# EAGLE schematic MotorDriver (EAGLE 9.6.2)

## Sheet 1 of 5
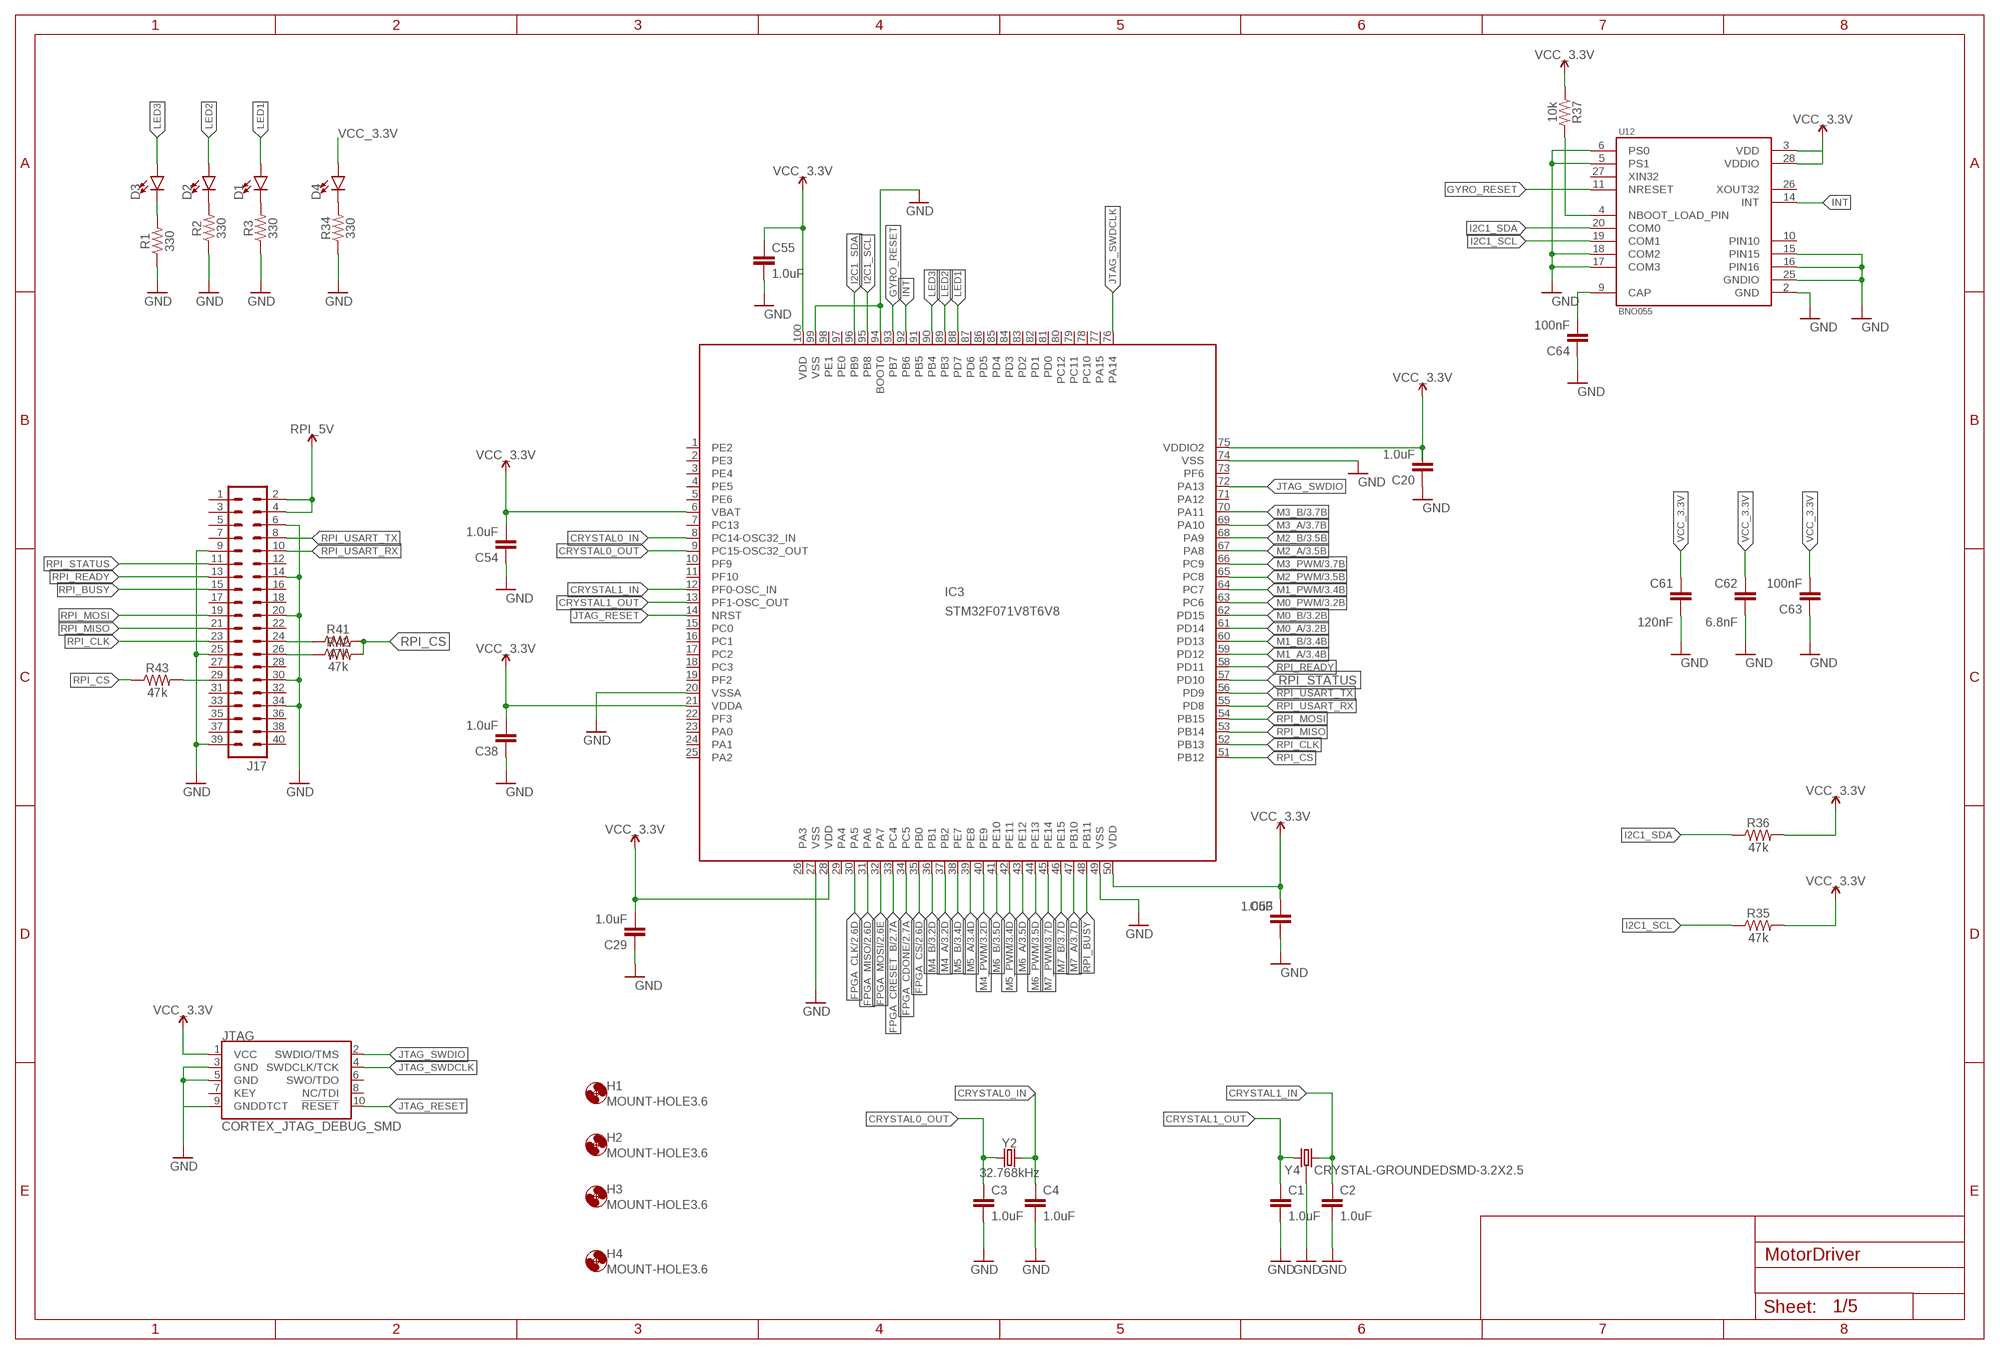
[diagram p0: schematic, sheet 1]

### Parts
C1  1.0uF  1.0UF-0402T-16V-10%  [0402-TIGHT]
C2  1.0uF  1.0UF-0402T-16V-10%  [0402-TIGHT]
C3  1.0uF  1.0UF-0402T-16V-10%  [0402-TIGHT]
C4  1.0uF  1.0UF-0402T-16V-10%  [0402-TIGHT]
C20  1.0uF  1.0UF-0402T-16V-10%  [0402-TIGHT]
C29  1.0uF  1.0UF-0402T-16V-10%  [0402-TIGHT]
C38  1.0uF  1.0UF-0402T-16V-10%  [0402-TIGHT]
C53  1.0uF  1.0UF-0402T-16V-10%  [0402-TIGHT]
C54  1.0uF  1.0UF-0402T-16V-10%  [0402-TIGHT]
C55  1.0uF  1.0UF-0402T-16V-10%  [0402-TIGHT]
C61  120nF  1.0UF-0402T-16V-10%  [0402-TIGHT]
C62  6.8nF  1.0UF-0402T-16V-10%  [0402-TIGHT]
C63  100nF  1.0UF-0402T-16V-10%  [0402-TIGHT]
C64  100nF  1.0UF-0402T-16V-10%  [0402-TIGHT]
D1  LED0603  [LED-0603]
D2  LED0603  [LED-0603]
D3  LED0603  [LED-0603]
D4  LED0603  [LED-0603]
H1  MOUNT-HOLE3.6  [3,6]
H2  MOUNT-HOLE3.6  [3,6]
H3  MOUNT-HOLE3.6  [3,6]
H4  MOUNT-HOLE3.6  [3,6]
IC3  STM32F071V8T6V8  [LQFP100_14X14]
J17  MA20-2  [MA20-2]
JTAG  CORTEX_JTAG_DEBUG_SMD  [2X5-SMD-1.27MM]
R1  330  330OHM-0603-1/10W-1%  [0603]
R2  330  330OHM-0603-1/10W-1%  [0603]
R3  330  330OHM-0603-1/10W-1%  [0603]
R34  330  330OHM-0603-1/10W-1%  [0603]
R35  47k  2.2KOHM-0402T-1/16W-1%  [0402-TIGHT]
R36  47k  2.2KOHM-0402T-1/16W-1%  [0402-TIGHT]
R37  10k  2.2KOHM-0402T-1/16W-1%  [0402-TIGHT]
R41  47k  2.2KOHM-0402T-1/16W-1%  [0402-TIGHT]
R42  47k  2.2KOHM-0402T-1/16W-1%  [0402-TIGHT]
R43  47k  2.2KOHM-0402T-1/16W-1%  [0402-TIGHT]
U12  BNO055  [LGA28R50P4X10_380X520X100]
Y2  32.768kHz  CRYSTAL-32.768KHZSMD-3.2X1.5  [CRYSTAL-SMD-3.2X1.5MM]
Y4  CRYSTAL-GROUNDEDSMD-3.2X2.5  [CRYSTAL-SMD-3.2X2.5MM]

### Nets
CRYSTAL0_IN: C4.1 IC3.8(PC14-OSC32_IN) Y2.P$2
CRYSTAL0_OUT: C3.1 IC3.9(PC15-OSC32_OUT) Y2.P$1
CRYSTAL1_IN: C2.1 IC3.12(PF0-OSC_IN) Y4.3
CRYSTAL1_OUT: C1.1 IC3.13(PF1-OSC_OUT) Y4.1
FPGA_CDONE: IC3.34(PC5) ; also sheet 2
FPGA_CLK: IC3.30(PA5) ; also sheet 2
FPGA_CRESET_B: IC3.33(PC4) ; also sheet 2
FPGA_CS: IC3.35(PB0) ; also sheet 2
FPGA_MISO: IC3.31(PA6) ; also sheet 2
FPGA_MOSI: IC3.32(PA7) ; also sheet 2
GND: C1.2 C2.2 C3.2 C4.2 C20.1 C29.1 C38.1 C53.1 C54.1 C55.2 C61.1 C62.1 C63.1 C64.1 IC3.20(VSSA) IC3.27(VSS) IC3.49(VSS) IC3.74(VSS) IC3.94(BOOT0) IC3.99(VSS) J17.6 J17.9 J17.14 J17.20 J17.25 J17.30 J17.34 J17.39 JTAG.3(GND) JTAG.5(GND) JTAG.9(GNDDTCT) R1.1 R2.1 R3.1 R34.1 U12.2(GND) U12.5(PS1) U12.6(PS0) U12.15(PIN15) U12.16(PIN16) U12.17(COM3) U12.18(COM2) U12.25(GNDIO) Y4.2 Y4.4 ; also sheet 2,3,4,5
GYRO_RESET: IC3.93(PB7) U12.11(NRESET)
I2C1_SCL: IC3.95(PB8) R35.1 U12.19(COM1)
I2C1_SDA: IC3.96(PB9) R36.1 U12.20(COM0)
INT: IC3.92(PB6) U12.14(INT)
JTAG_RESET: IC3.14(NRST) JTAG.10(!RESET)
JTAG_SWDCLK: IC3.76(PA14) JTAG.4(SWDCLK/TCK)
JTAG_SWDIO: IC3.72(PA13) JTAG.2(SWDIO/TMS)
LED1: D1.A IC3.88(PD7)
LED2: D2.A IC3.89(PB3)
LED3: D3.A IC3.90(PB4)
M0_A: IC3.61(PD14) ; also sheet 3
M0_B: IC3.62(PD15) ; also sheet 3
M0_PWM: IC3.63(PC6) ; also sheet 3
M1_A: IC3.59(PD12) ; also sheet 3
M1_B: IC3.60(PD13) ; also sheet 3
M1_PWM: IC3.64(PC7) ; also sheet 3
M2_A: IC3.67(PA8) ; also sheet 3
M2_B: IC3.68(PA9) ; also sheet 3
M2_PWM: IC3.65(PC8) ; also sheet 3
M3_A: IC3.69(PA10) ; also sheet 3
M3_B: IC3.70(PA11) ; also sheet 3
M3_PWM: IC3.66(PC9) ; also sheet 3
M4_A: IC3.37(PB2) ; also sheet 3
M4_B: IC3.36(PB1) ; also sheet 3
M4_PWM: IC3.40(PE9) ; also sheet 3
M5_A: IC3.39(PE8) ; also sheet 3
M5_B: IC3.38(PE7) ; also sheet 3
M5_PWM: IC3.42(PE11) ; also sheet 3
M6_A: IC3.43(PE12) ; also sheet 3
M6_B: IC3.41(PE10) ; also sheet 3
M6_PWM: IC3.44(PE13) ; also sheet 3
M7_A: IC3.47(PB10) ; also sheet 3
M7_B: IC3.46(PE15) ; also sheet 3
M7_PWM: IC3.45(PE14) ; also sheet 3
N$1: D3.C R1.2
N$2: D2.C R2.2
N$3: D1.C R3.2
N$5: D4.C R34.2
N$6: R37.2 U12.4(NBOOT_LOAD_PIN)
N$9: C64.2 U12.9(CAP)
N$12: J17.24 R41.1
N$19: J17.26 R42.1
N$38: J17.29 R43.2
RPI_5V: J17.2 J17.4 ; also sheet 5
RPI_BUSY: IC3.48(PB11) J17.15
RPI_CLK: IC3.52(PB13) J17.23
RPI_CS: IC3.51(PB12) R41.2 R42.2 R43.1
RPI_MISO: IC3.53(PB14) J17.21
RPI_MOSI: IC3.54(PB15) J17.19
RPI_READY: IC3.58(PD11) J17.13
RPI_STATUS: IC3.57(PD10) J17.11
RPI_USART_RX: IC3.55(PD8) J17.10
RPI_USART_TX: IC3.56(PD9) J17.8
VCC_3.3V: C20.2 C29.2 C38.2 C53.2 C54.2 C55.1 C61.2 C62.2 C63.2 D4.A IC3.6(VBAT) IC3.21(VDDA) IC3.28(VDD) IC3.50(VDD) IC3.75(VDDIO2) IC3.100(VDD) JTAG.1(VCC) R35.2 R36.2 R37.1 U12.3(VDD) U12.28(VDDIO) ; also sheet 2,5
Unconnected: IC3.1(PE2) IC3.2(PE3) IC3.3(PE4) IC3.4(PE5) IC3.5(PE6) IC3.7(PC13) IC3.10(PF9) IC3.11(PF10) IC3.15(PC0) IC3.16(PC1) IC3.17(PC2) IC3.18(PC3) IC3.19(PF2) IC3.23(PA0) IC3.24(PA1) IC3.25(PA2) IC3.26(PA3) IC3.29(PA4) IC3.71(PA12) IC3.73(PF6) IC3.77(PA15) IC3.78(PC10) IC3.79(PC11) IC3.80(PC12) IC3.81(PD0) IC3.82(PD1) IC3.83(PD2) IC3.84(PD3) IC3.85(PD4) IC3.86(PD5) IC3.87(PD6) IC3.91(PB5) IC3.97(PE0) IC3.98(PE1) J17.1 J17.3 J17.5 J17.7 J17.12 J17.16 J17.17 J17.18 J17.22 J17.27 J17.28 J17.31 J17.32 J17.33 J17.35 J17.36 J17.37 J17.38 J17.40 JTAG.6(SWO/TDO) JTAG.7(KEY) JTAG.8(NC/TDI) U12.26(XOUT32) U12.27(XIN32)

## Sheet 2 of 5
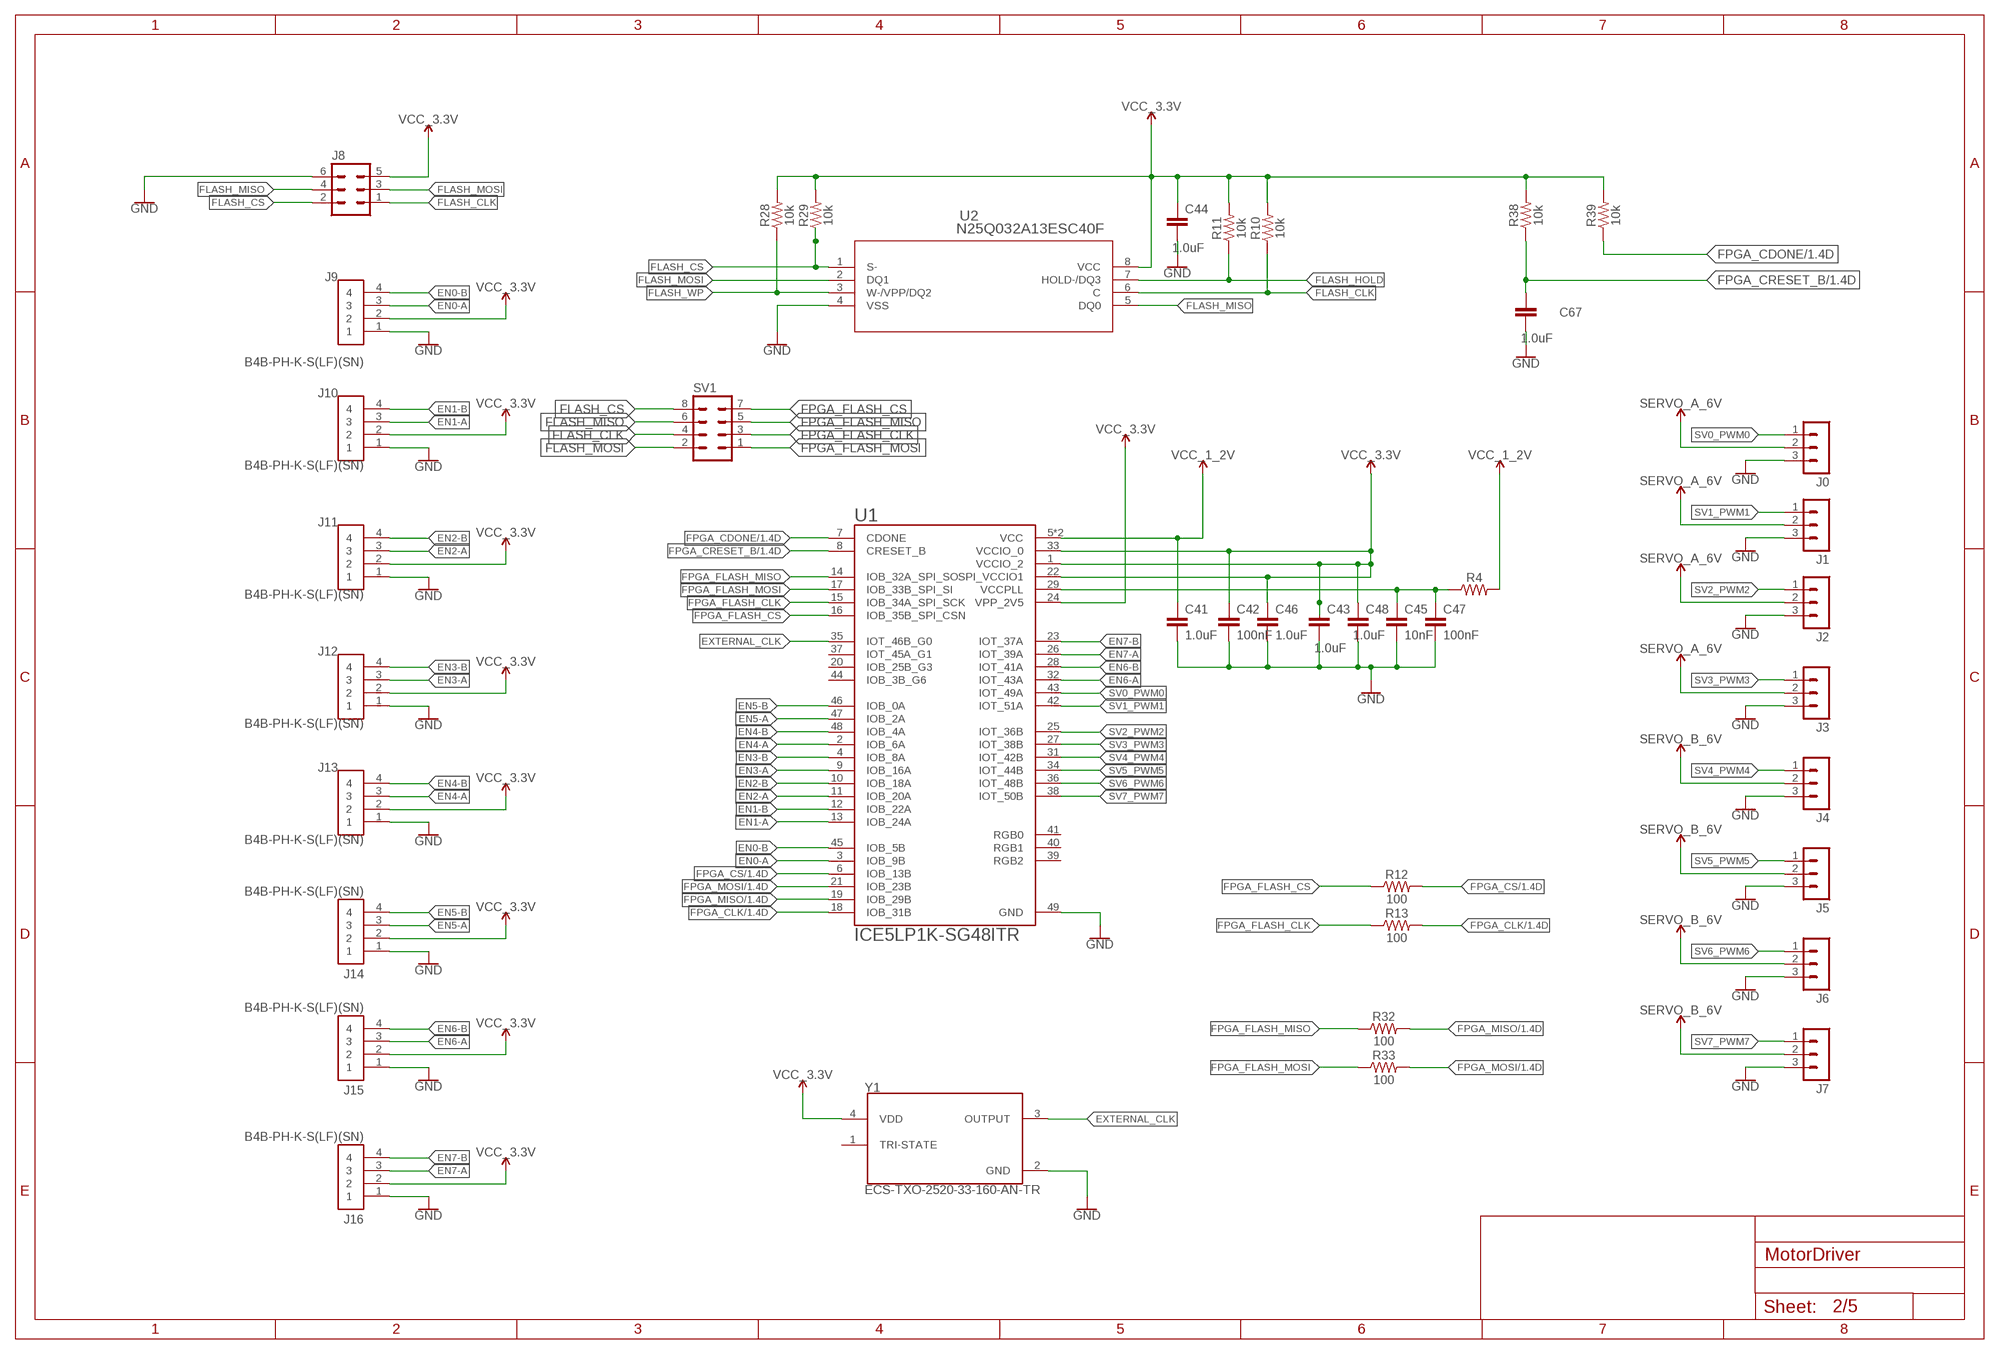
[diagram p1: schematic, sheet 2]

### Parts
C41  1.0uF  1.0UF-0402T-16V-10%  [0402-TIGHT]
C42  100nF  1.0UF-0402T-16V-10%  [0402-TIGHT]
C43  1.0uF  1.0UF-0402T-16V-10%  [0402-TIGHT]
C44  1.0uF  1.0UF-0402T-16V-10%  [0402-TIGHT]
C45  10nF  1.0UF-0402T-16V-10%  [0402-TIGHT]
C46  1.0uF  1.0UF-0402T-16V-10%  [0402-TIGHT]
C47  100nF  1.0UF-0402T-16V-10%  [0402-TIGHT]
C48  1.0uF  1.0UF-0402T-16V-10%  [0402-TIGHT]
C67  1.0uF  1.0UF-0402T-16V-10%  [0402-TIGHT]
J0  MA03-1  [MA03-1]
J1  MA03-1  [MA03-1]
J2  MA03-1  [MA03-1]
J3  MA03-1  [MA03-1]
J4  MA03-1  [MA03-1]
J5  MA03-1  [MA03-1]
J6  MA03-1  [MA03-1]
J7  MA03-1  [MA03-1]
J8  MA03-2  [MA03-2]
J9  B4B-PH-K-S(LF)(SN)  [JST_B4B-PH-K-S(LF)(SN)]
J10  B4B-PH-K-S(LF)(SN)  [JST_B4B-PH-K-S(LF)(SN)]
J11  B4B-PH-K-S(LF)(SN)  [JST_B4B-PH-K-S(LF)(SN)]
J12  B4B-PH-K-S(LF)(SN)  [JST_B4B-PH-K-S(LF)(SN)]
J13  B4B-PH-K-S(LF)(SN)  [JST_B4B-PH-K-S(LF)(SN)]
J14  B4B-PH-K-S(LF)(SN)  [JST_B4B-PH-K-S(LF)(SN)]
J15  B4B-PH-K-S(LF)(SN)  [JST_B4B-PH-K-S(LF)(SN)]
J16  B4B-PH-K-S(LF)(SN)  [JST_B4B-PH-K-S(LF)(SN)]
R4  100  2.2KOHM-0402T-1/16W-1%  [0402-TIGHT]
R10  10k  10KOHM-0603-1/10W-1%  [0603]
R11  10k  10KOHM-0603-1/10W-1%  [0603]
R12  100  100OHM-0603-1/4W-5%  [0603]
R13  100  100OHM-0603-1/4W-5%  [0603]
R28  10k  10KOHM-0603-1/10W-1%  [0603]
R29  10k  10KOHM-0603-1/10W-1%  [0603]
R32  100  100OHM-0603-1/4W-5%  [0603]
R33  100  100OHM-0603-1/4W-5%  [0603]
R38  10k  10KOHM-0603-1/10W-1%  [0603]
R39  10k  10KOHM-0603-1/10W-1%  [0603]
SV1  MA04-2  [MA04-2]
U1  ICE5LP1K-SG48ITR  [QFN50P700X700X100-49N]
U2  N25Q032A13ESC40F  [SO8N_5X4_MRN]
Y1  ECS-TXO-2520-33-160-AN-TR  [OSC_ECS-TXO-2520-33-160-AN-TR]

### Nets
EN0-A: J9.3 U1.3(IOB_9B)
EN0-B: J9.4 U1.45(IOB_5B)
EN1-A: J10.3 U1.13(IOB_24A)
EN1-B: J10.4 U1.12(IOB_22A)
EN2-A: J11.3 U1.11(IOB_20A)
EN2-B: J11.4 U1.10(IOB_18A)
EN3-A: J12.3 U1.9(IOB_16A)
EN3-B: J12.4 U1.4(IOB_8A)
EN4-A: J13.3 U1.2(IOB_6A)
EN4-B: J13.4 U1.48(IOB_4A)
EN5-A: J14.3 U1.47(IOB_2A)
EN5-B: J14.4 U1.46(IOB_0A)
EN6-A: J15.3 U1.32(IOT_43A)
EN6-B: J15.4 U1.28(IOT_41A)
EN7-A: J16.3 U1.26(IOT_39A)
EN7-B: J16.4 U1.23(IOT_37A)
EXTERNAL_CLK: U1.35(IOT_46B_G0) Y1.3(OUTPUT)
FLASH_CLK: J8.1 R10.1 SV1.4 U2.6(C)
FLASH_CS: J8.2 R29.1 SV1.8 U2.1(S-)
FLASH_HOLD: R11.1 U2.7(HOLD-/DQ3)
FLASH_MISO: J8.4 SV1.6 U2.5(DQ0)
FLASH_MOSI: J8.3 SV1.2 U2.2(DQ1)
FLASH_WP: R28.1 U2.3(W-/VPP/DQ2)
FPGA_CDONE: R39.1 U1.7(CDONE) ; also sheet 1
FPGA_CLK: R13.2 U1.18(IOB_31B) ; also sheet 1
FPGA_CRESET_B: C67.1 R38.1 U1.8(CRESET_B) ; also sheet 1
FPGA_CS: R12.2 U1.6(IOB_13B) ; also sheet 1
FPGA_FLASH_CLK: R13.1 SV1.3 U1.15(IOB_34A_SPI_SCK)
FPGA_FLASH_CS: R12.1 SV1.7 U1.16(IOB_35B_SPI_CSN)
FPGA_FLASH_MISO: R32.1 SV1.5 U1.14(IOB_32A_SPI_SO)
FPGA_FLASH_MOSI: R33.1 SV1.1 U1.17(IOB_33B_SPI_SI)
FPGA_MISO: R32.2 U1.19(IOB_29B) ; also sheet 1
FPGA_MOSI: R33.2 U1.21(IOB_23B) ; also sheet 1
GND: C41.2 C42.2 C43.2 C44.2 C45.2 C46.2 C47.2 C48.2 C67.2 J0.3 J1.3 J2.3 J3.3 J4.3 J5.3 J6.3 J7.3 J8.6 J9.1 J10.1 J11.1 J12.1 J13.1 J14.1 J15.1 J16.1 U1.49(GND) U2.4(VSS) Y1.2(GND) ; also sheet 1,3,4,5
N$8: C45.1 C47.1 R4.1 U1.29(VCCPLL)
SERVO_A_6V: J0.2 J1.2 J2.2 J3.2 ; also sheet 4
SERVO_B_6V: J4.2 J5.2 J6.2 J7.2 ; also sheet 4
SV0_PWM0: J0.1 U1.43(IOT_49A)
SV1_PWM1: J1.1 U1.42(IOT_51A)
SV2_PWM2: J2.1 U1.25(IOT_36B)
SV3_PWM3: J3.1 U1.27(IOT_38B)
SV4_PWM4: J4.1 U1.31(IOT_42B)
SV5_PWM5: J5.1 U1.34(IOT_44B)
SV6_PWM6: J6.1 U1.36(IOT_48B)
SV7_PWM7: J7.1 U1.38(IOT_50B)
VCC_1_2V: C41.1 R4.2 U1.5(VCC) U1.30(VCC) ; also sheet 5
VCC_3.3V: C42.1 C43.1 C44.1 C46.1 C48.1 J8.5 J9.2 J10.2 J11.2 J12.2 J13.2 J14.2 J15.2 J16.2 R10.2 R11.2 R28.2 R29.2 R38.2 R39.2 U1.1(VCCIO_2) U1.22(SPI_VCCIO1) U1.24(VPP_2V5) U1.33(VCCIO_0) U2.8(VCC) Y1.4(VDD) ; also sheet 1,5
Unconnected: U1.20(IOB_25B_G3) U1.37(IOT_45A_G1) U1.39(RGB2) U1.40(RGB1) U1.41(RGB0) U1.44(IOB_3B_G6) Y1.1(TRI-STATE)

## Sheet 3 of 5
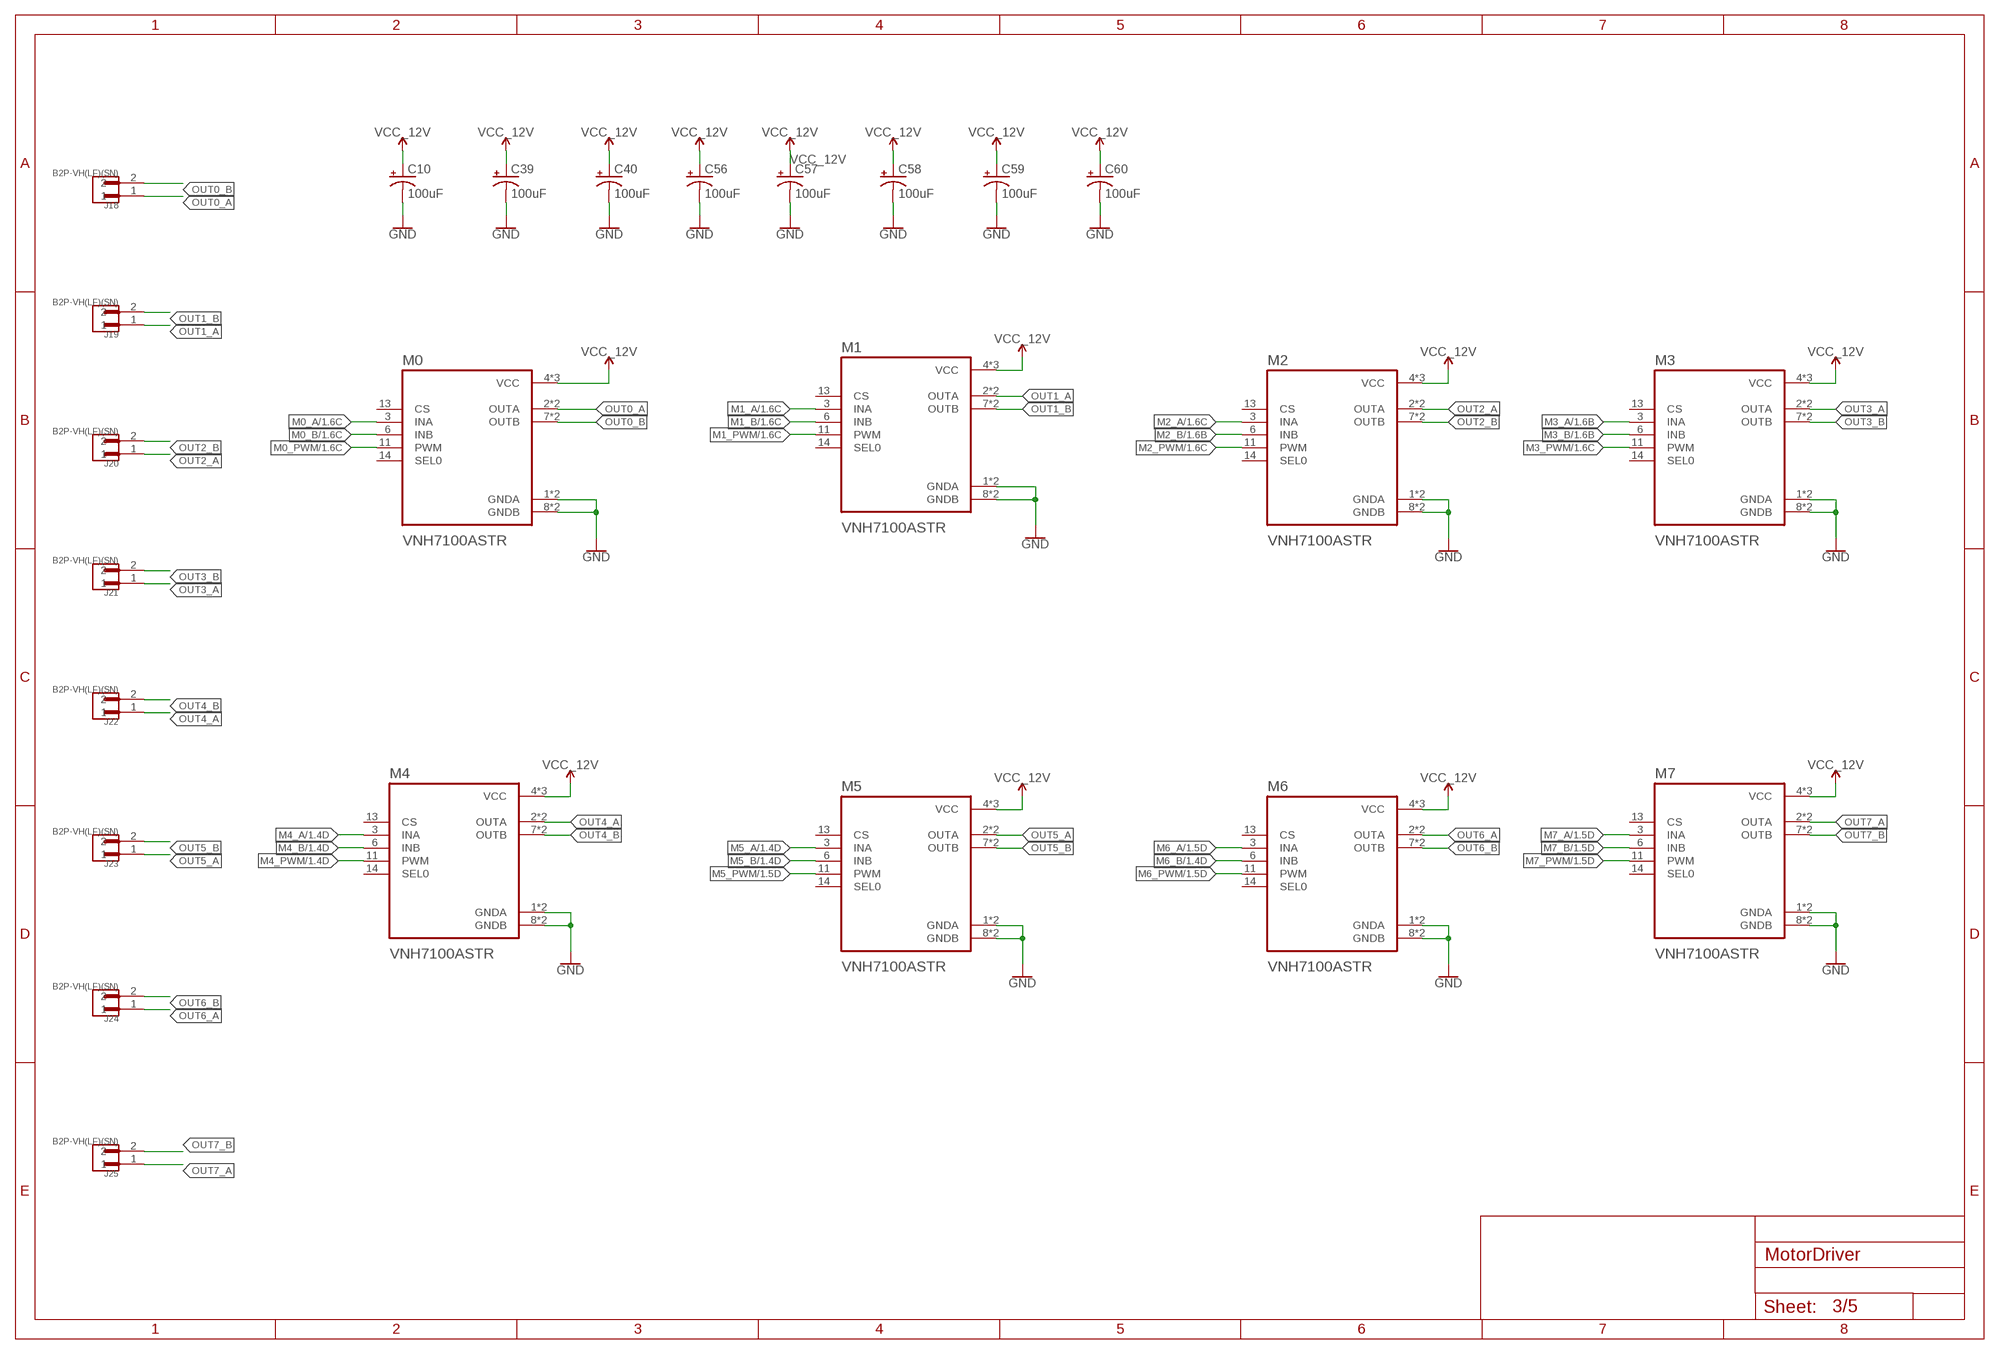
[diagram p2: schematic, sheet 3]

### Parts
C10  100uF  100UF-POLAR-25V-20%(ELEC)  [PANASONIC_D]
C39  100uF  100UF-POLAR-25V-20%(ELEC)  [PANASONIC_D]
C40  100uF  100UF-POLAR-25V-20%(ELEC)  [PANASONIC_D]
C56  100uF  100UF-POLAR-25V-20%(ELEC)  [PANASONIC_D]
C57  100uF  100UF-POLAR-25V-20%(ELEC)  [PANASONIC_D]
C58  100uF  100UF-POLAR-25V-20%(ELEC)  [PANASONIC_D]
C59  100uF  100UF-POLAR-25V-20%(ELEC)  [PANASONIC_D]
C60  100uF  100UF-POLAR-25V-20%(ELEC)  [PANASONIC_D]
J18  B2P-VH(LF)(SN)  [JST_B2P-VH(LF)(SN)]
J19  B2P-VH(LF)(SN)  [JST_B2P-VH(LF)(SN)]
J20  B2P-VH(LF)(SN)  [JST_B2P-VH(LF)(SN)]
J21  B2P-VH(LF)(SN)  [JST_B2P-VH(LF)(SN)]
J22  B2P-VH(LF)(SN)  [JST_B2P-VH(LF)(SN)]
J23  B2P-VH(LF)(SN)  [JST_B2P-VH(LF)(SN)]
J24  B2P-VH(LF)(SN)  [JST_B2P-VH(LF)(SN)]
J25  B2P-VH(LF)(SN)  [JST_B2P-VH(LF)(SN)]
M0  VNH7100ASTR  [SOIC127P600X175-16N]
M1  VNH7100ASTR  [SOIC127P600X175-16N]
M2  VNH7100ASTR  [SOIC127P600X175-16N]
M3  VNH7100ASTR  [SOIC127P600X175-16N]
M4  VNH7100ASTR  [SOIC127P600X175-16N]
M5  VNH7100ASTR  [SOIC127P600X175-16N]
M6  VNH7100ASTR  [SOIC127P600X175-16N]
M7  VNH7100ASTR  [SOIC127P600X175-16N]

### Nets
GND: C10.- C39.- C40.- C56.- C57.- C58.- C59.- C60.- M0.1(GNDA) M0.8(GNDB) M0.9(GNDB) M0.16(GNDA) M1.1(GNDA) M1.8(GNDB) M1.9(GNDB) M1.16(GNDA) M2.1(GNDA) M2.8(GNDB) M2.9(GNDB) M2.16(GNDA) M3.1(GNDA) M3.8(GNDB) M3.9(GNDB) M3.16(GNDA) M4.1(GNDA) M4.8(GNDB) M4.9(GNDB) M4.16(GNDA) M5.1(GNDA) M5.8(GNDB) M5.9(GNDB) M5.16(GNDA) M6.1(GNDA) M6.8(GNDB) M6.9(GNDB) M6.16(GNDA) M7.1(GNDA) M7.8(GNDB) M7.9(GNDB) M7.16(GNDA) ; also sheet 1,2,4,5
M0_A: M0.3(INA) ; also sheet 1
M0_B: M0.6(INB) ; also sheet 1
M0_PWM: M0.11(PWM) ; also sheet 1
M1_A: M1.3(INA) ; also sheet 1
M1_B: M1.6(INB) ; also sheet 1
M1_PWM: M1.11(PWM) ; also sheet 1
M2_A: M2.3(INA) ; also sheet 1
M2_B: M2.6(INB) ; also sheet 1
M2_PWM: M2.11(PWM) ; also sheet 1
M3_A: M3.3(INA) ; also sheet 1
M3_B: M3.6(INB) ; also sheet 1
M3_PWM: M3.11(PWM) ; also sheet 1
M4_A: M4.3(INA) ; also sheet 1
M4_B: M4.6(INB) ; also sheet 1
M4_PWM: M4.11(PWM) ; also sheet 1
M5_A: M5.3(INA) ; also sheet 1
M5_B: M5.6(INB) ; also sheet 1
M5_PWM: M5.11(PWM) ; also sheet 1
M6_A: M6.3(INA) ; also sheet 1
M6_B: M6.6(INB) ; also sheet 1
M6_PWM: M6.11(PWM) ; also sheet 1
M7_A: M7.3(INA) ; also sheet 1
M7_B: M7.6(INB) ; also sheet 1
M7_PWM: M7.11(PWM) ; also sheet 1
OUT0_A: J18.1 M0.2(OUTA) M0.15(OUTA)
OUT0_B: J18.2 M0.7(OUTB) M0.10(OUTB)
OUT1_A: J19.1 M1.2(OUTA) M1.15(OUTA)
OUT1_B: J19.2 M1.7(OUTB) M1.10(OUTB)
OUT2_A: J20.1 M2.2(OUTA) M2.15(OUTA)
OUT2_B: J20.2 M2.7(OUTB) M2.10(OUTB)
OUT3_A: J21.1 M3.2(OUTA) M3.15(OUTA)
OUT3_B: J21.2 M3.7(OUTB) M3.10(OUTB)
OUT4_A: J22.1 M4.2(OUTA) M4.15(OUTA)
OUT4_B: J22.2 M4.7(OUTB) M4.10(OUTB)
OUT5_A: J23.1 M5.2(OUTA) M5.15(OUTA)
OUT5_B: J23.2 M5.7(OUTB) M5.10(OUTB)
OUT6_A: J24.1 M6.2(OUTA) M6.15(OUTA)
OUT6_B: J24.2 M6.7(OUTB) M6.10(OUTB)
OUT7_A: J25.1 M7.2(OUTA) M7.15(OUTA)
OUT7_B: J25.2 M7.7(OUTB) M7.10(OUTB)
VCC_12V: C10.+ C39.+ C40.+ C56.+ C57.+ C58.+ C59.+ C60.+ M0.4(VCC) M0.5(VCC) M0.12(VCC) M1.4(VCC) M1.5(VCC) M1.12(VCC) M2.4(VCC) M2.5(VCC) M2.12(VCC) M3.4(VCC) M3.5(VCC) M3.12(VCC) M4.4(VCC) M4.5(VCC) M4.12(VCC) M5.4(VCC) M5.5(VCC) M5.12(VCC) M6.4(VCC) M6.5(VCC) M6.12(VCC) M7.4(VCC) M7.5(VCC) M7.12(VCC) ; also sheet 4,5
Unconnected: M0.13(CS) M0.14(SEL0) M1.13(CS) M1.14(SEL0) M2.13(CS) M2.14(SEL0) M3.13(CS) M3.14(SEL0) M4.13(CS) M4.14(SEL0) M5.13(CS) M5.14(SEL0) M6.13(CS) M6.14(SEL0) M7.13(CS) M7.14(SEL0)

## Sheet 4 of 5
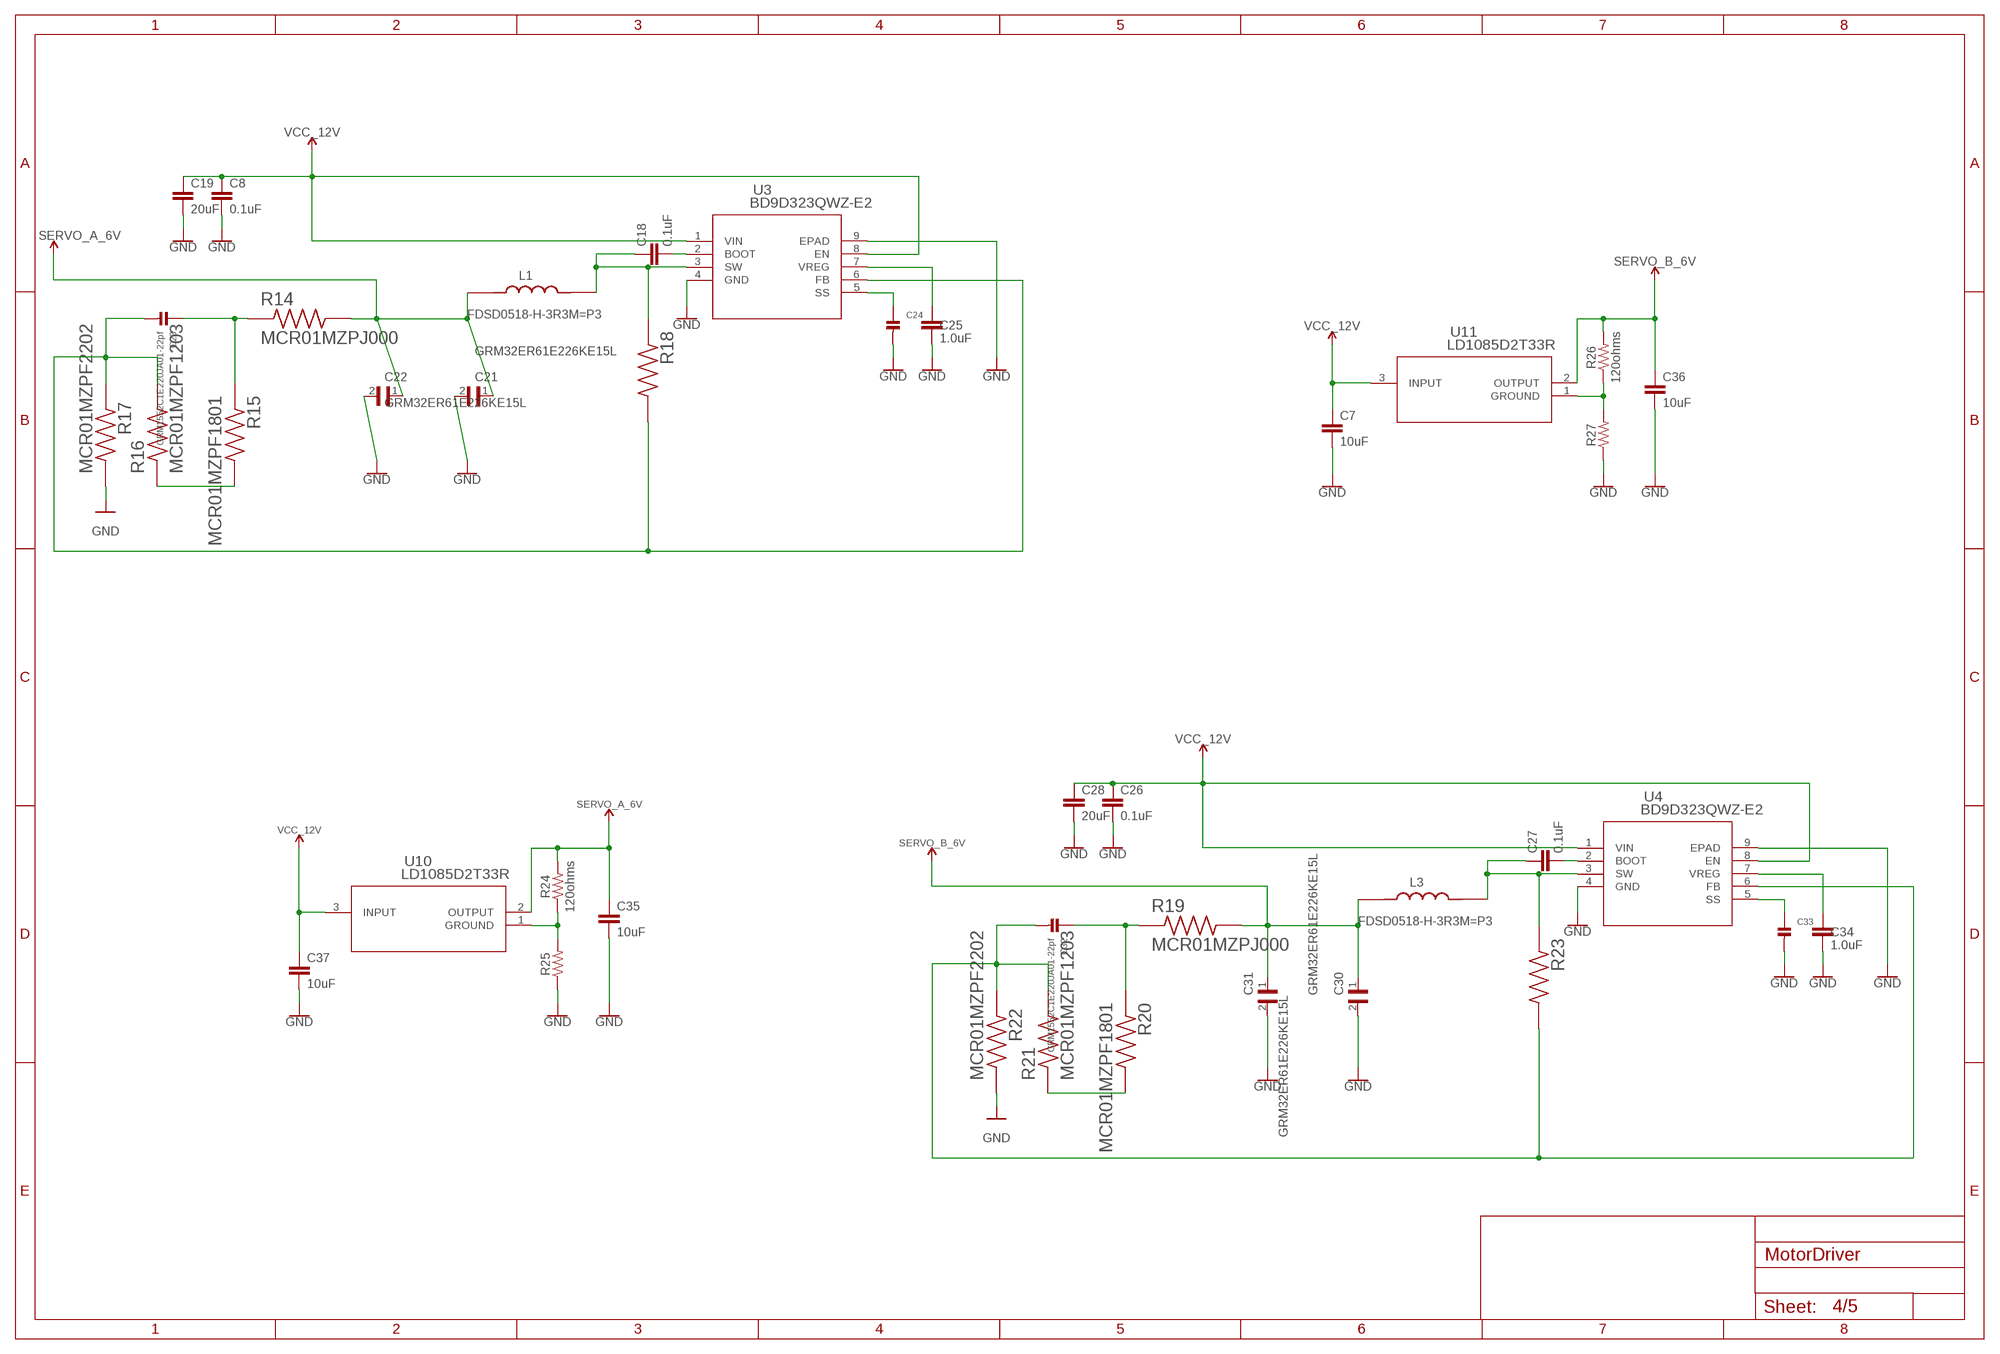
[diagram p3: schematic, sheet 4]

### Parts
C7  10uF  10UF-0805-25V-10%  [0805]
C8  0.1uF  0.1UF-0603-25V-(+80/-20%)  [0603]
C18  0.1uF  0.1UF-0603-25V-(+80/-20%)  [0603]
C19  20uF  10UF-1210-50V-20%  [1210]
C21  GRM32ER61E226KE15L  [CAPC3225X270N]
C22  GRM32ER61E226KE15L  [CAPC3225X270N]
C23  GRM1552C1E220JA01-22pf  CAP_CERAMIC0402  [0402]
C24  GRM155B11H332KA01J-3300pf  CAP_CERAMIC0402  [0402]
C25  1.0uF  1.0UF-0603-16V-10%  [0603]
C26  0.1uF  0.1UF-0603-25V-(+80/-20%)  [0603]
C27  0.1uF  0.1UF-0603-25V-(+80/-20%)  [0603]
C28  20uF  10UF-1210-50V-20%  [1210]
C30  GRM32ER61E226KE15L  [CAPC3225X270N]
C31  GRM32ER61E226KE15L  [CAPC3225X270N]
C32  GRM1552C1E220JA01-22pf  CAP_CERAMIC0402  [0402]
C33  GRM155B11H332KA01J-3300pf  CAP_CERAMIC0402  [0402]
C34  1.0uF  1.0UF-0603-16V-10%  [0603]
C35  10uF  10UF-0805-25V-10%  [0805]
C36  10uF  10UF-0805-25V-10%  [0805]
C37  10uF  10UF-0805-25V-10%  [0805]
L1  FDSD0518-H-3R3M=P3  [IND_FDSD0518-H-3R3M=P3]
L3  FDSD0518-H-3R3M=P3  [IND_FDSD0518-H-3R3M=P3]
R14  MCR01MZPJ000  [RESC1005X40N]
R15  MCR01MZPF1801  [RESC1005X40N]
R16  MCR01MZPF1203  [RESC1005X40N]
R17  MCR01MZPF2202  [RESC1005X40N]
R18  MCR01MZPF1801  [RESC1005X40N]
R19  MCR01MZPJ000  [RESC1005X40N]
R20  MCR01MZPF1801  [RESC1005X40N]
R21  MCR01MZPF1203  [RESC1005X40N]
R22  MCR01MZPF2202  [RESC1005X40N]
R23  MCR01MZPF1801  [RESC1005X40N]
R24  120ohms  124KOHM  [0603]
R25  120ohms  124KOHM  [0603]
R26  120ohms  124KOHM  [0603]
R27  120ohms  124KOHM  [0603]
U3  BD9D323QWZ-E2  [UMMP008Z2020_ROM]
U4  BD9D323QWZ-E2  [UMMP008Z2020_ROM]
U10  LD1085D2T33R  [D2PAK_STM]
U11  LD1085D2T33R  [D2PAK_STM]

### Nets
GND: C7.2 C8.2 C19.2 C21.2 C22.2 C24.2 C25.2 C26.2 C28.2 C30.2 C31.2 C33.2 C34.2 C35.2 C36.2 C37.2 R17.1 R22.1 R25.1 R27.1 U3.4(GND) U3.9(EPAD) U4.4(GND) U4.9(EPAD) ; also sheet 1,2,3,5
N$20: C18.2 U3.2(BOOT)
N$21: C23.1 R14.1 R15.1
N$24: R15.2 R16.1
N$25: C18.1 L1.2 R18.1 U3.3(SW)
N$26: C24.1 U3.5(SS)
N$27: C25.1 U3.7(VREG)
N$28: C23.2 R16.2 R17.2 R18.2 U3.6(FB)
N$29: C27.2 U4.2(BOOT)
N$30: C32.1 R19.1 R20.1
N$31: R20.2 R21.1
N$32: C27.1 L3.2 R23.1 U4.3(SW)
N$33: C33.1 U4.5(SS)
N$34: C34.1 U4.7(VREG)
N$35: C32.2 R21.2 R22.2 R23.2 U4.6(FB)
N$36: R24.1 R25.2 U10.1(GROUND)
N$37: R26.1 R27.2 U11.1(GROUND)
SERVO_A_6V: C21.1 C22.1 C35.1 L1.1 R14.2 R24.2 U10.2(OUTPUT) ; also sheet 2
SERVO_B_6V: C30.1 C31.1 C36.1 L3.1 R19.2 R26.2 U11.2(OUTPUT) ; also sheet 2
VCC_12V: C7.1 C8.1 C19.1 C26.1 C28.1 C37.1 U3.1(VIN) U3.8(EN) U4.1(VIN) U4.8(EN) U10.3(INPUT) U11.3(INPUT) ; also sheet 3,5

## Sheet 5 of 5
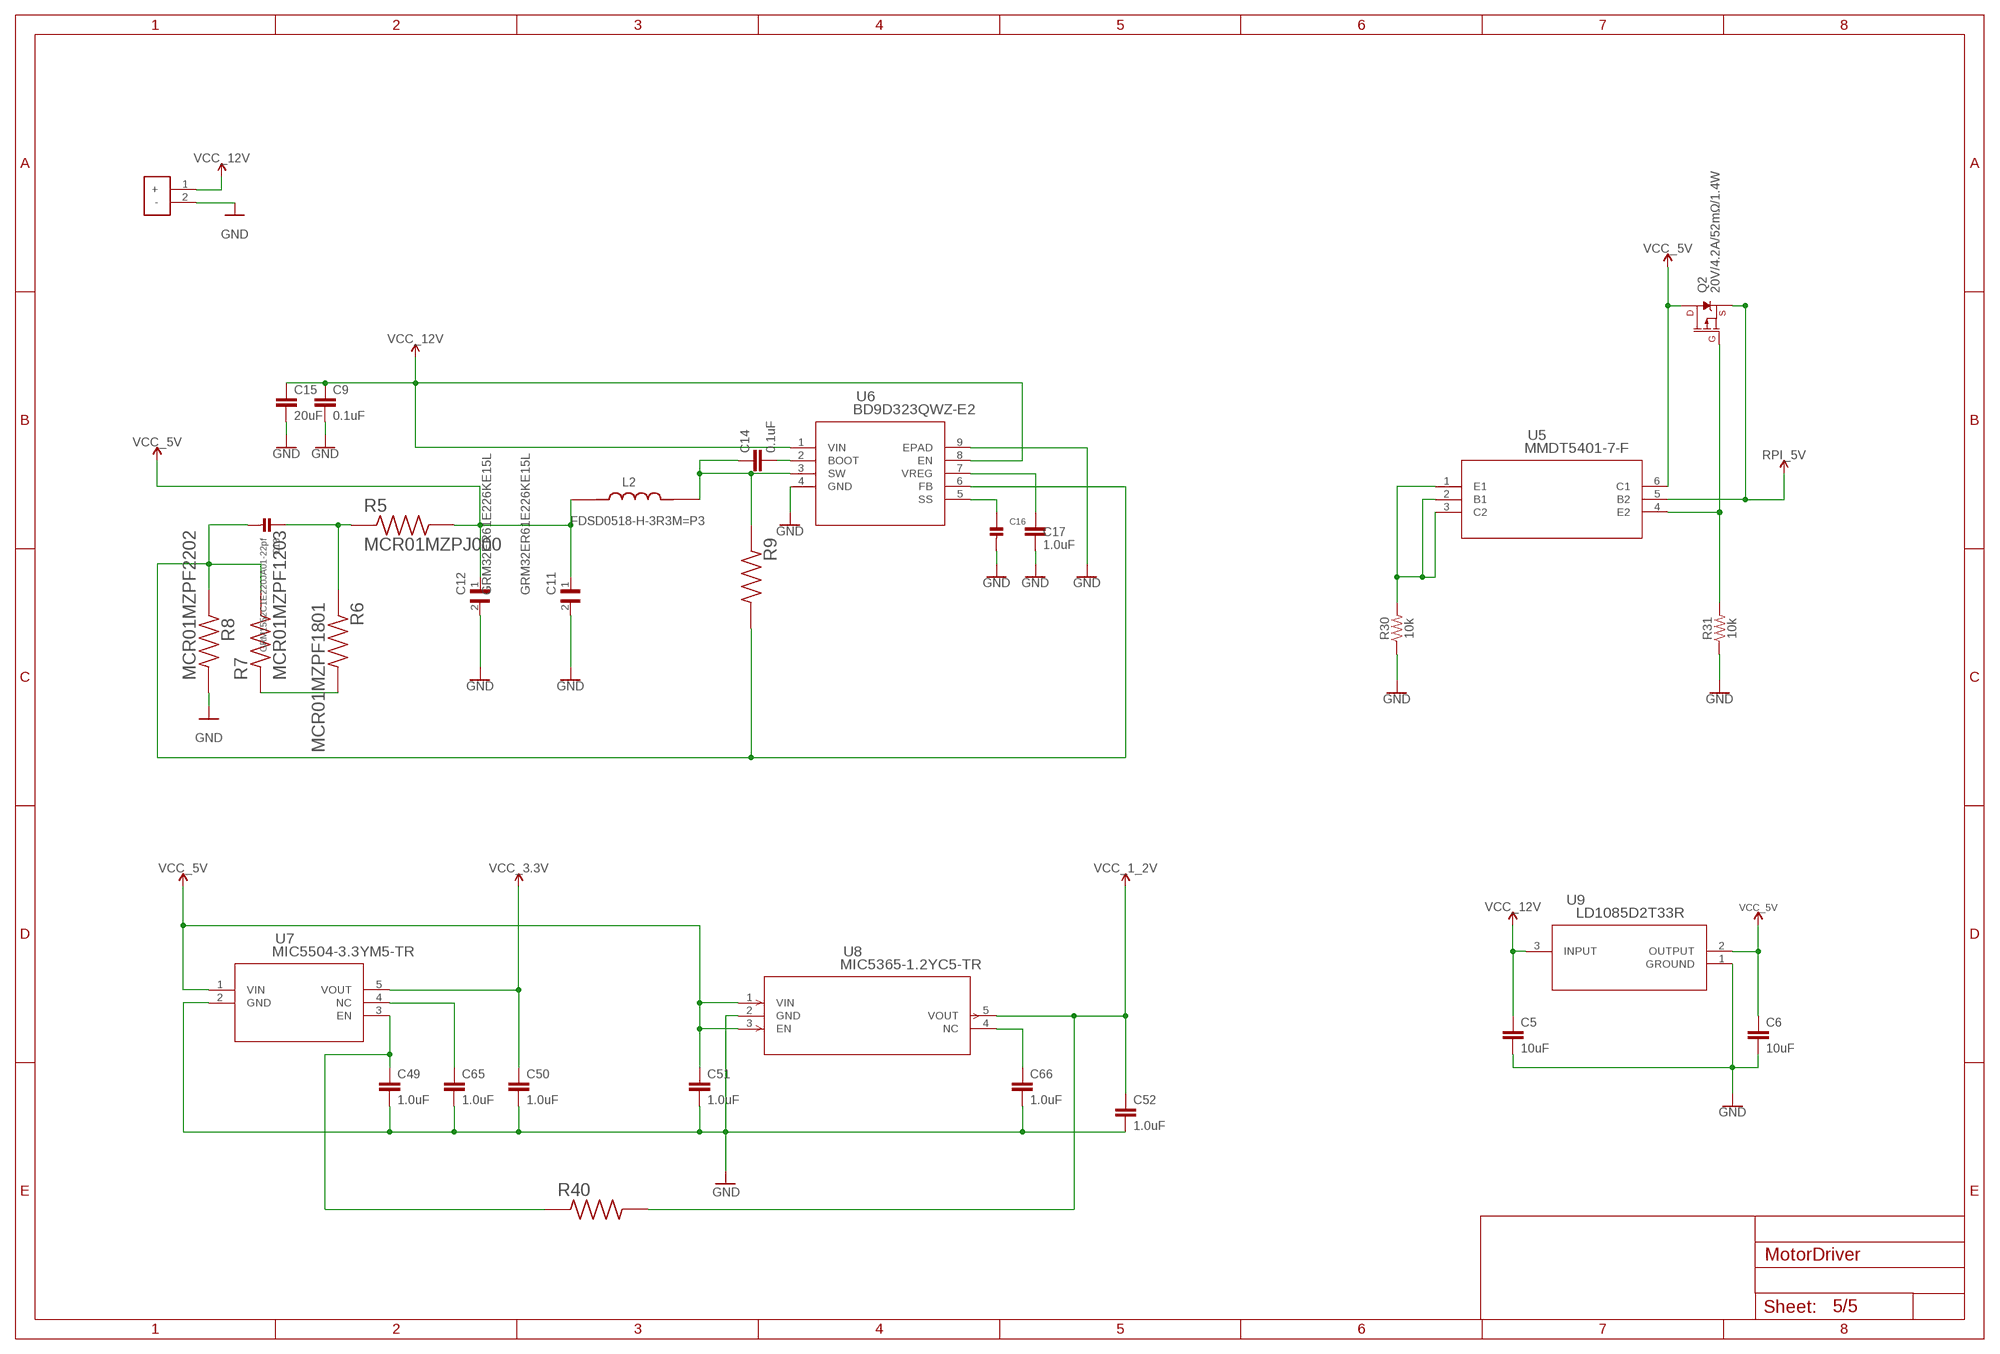
[diagram p4: schematic, sheet 5]

### Parts
C5  10uF  10UF-0805-25V-10%  [0805]
C6  10uF  10UF-0805-25V-10%  [0805]
C9  0.1uF  0.1UF-0603-25V-(+80/-20%)  [0603]
C11  GRM32ER61E226KE15L  [CAPC3225X270N]
C12  GRM32ER61E226KE15L  [CAPC3225X270N]
C13  GRM1552C1E220JA01-22pf  CAP_CERAMIC0402  [0402]
C14  0.1uF  0.1UF-0603-25V-(+80/-20%)  [0603]
C15  20uF  10UF-1210-50V-20%  [1210]
C16  GRM155B11H332KA01J-3300pf  CAP_CERAMIC0402  [0402]
C17  1.0uF  1.0UF-0603-16V-10%  [0603]
C49  1.0uF  1.0UF-0603-16V-10%  [0603]
C50  1.0uF  1.0UF-0603-16V-10%  [0603]
C51  1.0uF  1.0UF-0603-16V-10%  [0603]
C52  1.0uF  1.0UF-0603-16V-10%  [0603]
C65  1.0uF  1.0UF-0603-16V-10%  [0603]
C66  1.0uF  1.0UF-0603-16V-10%  [0603]
J26  XT30PWXT30PW  [XT30PW]
L2  FDSD0518-H-3R3M=P3  [IND_FDSD0518-H-3R3M=P3]
Q2  20V/4.2A/52mΩ/1.4W  MOSFET_PCH-DMG2305UX-7  [SOT23-3]
R5  MCR01MZPJ000  [RESC1005X40N]
R6  MCR01MZPF1801  [RESC1005X40N]
R7  MCR01MZPF1203  [RESC1005X40N]
R8  MCR01MZPF2202  [RESC1005X40N]
R9  MCR01MZPF1801  [RESC1005X40N]
R30  10k  10KOHM-0603-1/10W-1%  [0603]
R31  10k  10KOHM-0603-1/10W-1%  [0603]
R40  MCR01MZPF1801  [RESC1005X40N]
U5  MMDT5401-7-F  [SOT-363_DIO]
U6  BD9D323QWZ-E2  [UMMP008Z2020_ROM]
U7  MIC5504-3.3YM5-TR  [SOT-23-5_MC_MCH]
U8  MIC5365-1.2YC5-TR  [SC-70_C5_MCH]
U9  LD1085D2T33R  [D2PAK_STM]

### Nets
GND: C5.2 C6.2 C9.2 C11.2 C12.2 C15.2 C16.2 C17.2 C49.2 C50.2 C51.2 C52.2 C65.2 C66.2 J26.2(-) R8.1 R30.1 R31.1 U6.4(GND) U6.9(EPAD) U7.2(GND) U8.2(GND) U9.1(GROUND) ; also sheet 1,2,3,4
N$4: C14.2 U6.2(BOOT)
N$7: C49.1 R40.1 U7.3(EN)
N$10: C66.1 U8.4(NC)
N$11: C65.1 U7.4(NC)
N$13: C16.1 U6.5(SS)
N$14: C13.1 R5.1 R6.1
N$15: R6.2 R7.1
N$16: C13.2 R7.2 R8.2 R9.2 U6.6(FB)
N$17: C17.1 U6.7(VREG)
N$18: C14.1 L2.2 R9.1 U6.3(SW)
N$22: Q2.1(G) R31.2 U5.4(E2)
N$23: R30.2 U5.1(E1) U5.2(B1) U5.3(C2)
RPI_5V: Q2.2(S) U5.5(B2) ; also sheet 1
VCC_1_2V: C52.1 R40.2 U8.5(VOUT) ; also sheet 2
VCC_3.3V: C50.1 U7.5(VOUT) ; also sheet 1,2
VCC_5V: C6.1 C11.1 C12.1 C51.1 L2.1 Q2.3(D) R5.2 U5.6(C1) U7.1(VIN) U8.1(VIN) U8.3(EN) U9.2(OUTPUT)
VCC_12V: C5.1 C9.1 C15.1 J26.1(+) U6.1(VIN) U6.8(EN) U9.3(INPUT) ; also sheet 3,4

## Power pins joined to a net without a drawn wire
PF3: IC3.22(PF3)
PIN10: U12.10(PIN10)

## Library data of the parts
C1-C4 C20 C29 C38 C41 C43 C44 C46 C48 C53-C55 C67 = SparkFun-Capacitors:1.0UF: 1µF ceramic capacitors A capacitor is a passive two-terminal electrical component used to store electrical energy temporarily in an electric field.; PROD_ID: CAP-12417
C5-C7 C35-C37 = SparkFun-Capacitors:10UF: 10.0µF ceramic capacitors A capacitor is a passive two-terminal electrical component used to store electrical energy temporarily in an electric field.; PROD_ID: CAP-14259
C8 C9 C14 C18 C26 C27 = SparkFun-Capacitors:0.1UF: 0.1µF ceramic capacitors A capacitor is a passive two-terminal electrical component used to store electrical energy temporarily in an electric field.; PROD_ID: CAP-00810
C10 C39 C40 C56-C60 = SparkFun-Capacitors:100UF-POLAR: 100µF polarized capacitors A capacitor is a passive two-terminal electrical component used to store electrical energy temporarily in an electric field.; PROD_ID: CAP-12547
C11 C12 C21 C22 C30 C31 = GRM32ER61E226KE15L:GRM32ER61E226KE15L: Capacitor [Murata] GRM32ER61E226KE15L Capacitor; ARROW_ELECTRONICS-PURCHASE-URL: https://snapeda.com/shop?store=Arrow+Electronics&id=363586; DESCRIPTION: SMD Capacitor X5R(EIA) with Capacitance: 22uF Tol. 10%. Rated Voltage: 25Vdc; DIGI-KEY_PART_NUMBER: 490-3889-1-ND; DIGIKEY-PURCHASE-URL: https://snapeda.com/shop?store=DigiKey&id=363586; MF: Murata Electronics; MOUSER-PURCHASE-URL: https://snapeda.com/shop?store=Mouser&id=363586; MP: GRM32ER61E226KE15L; PACKAGE: 1210 Murata
C13 C16 C23 C24 C32 C33 = microbuilder:CAP_CERAMIC: Ceramic Capacitors 0402 - 0402 Surface Mount Capacitors 16pF 50V 5% [Digikey: 445-4899-2-ND] 18pF 50V 5% [Digikey: 490-1281-2-ND] 22pF 50V 5% [Digikey: 490-1283-2-ND] 68pF 50V 5% [Digikey: 490-1289-2-ND] 0.1uF 10V 10% [Digikey: 490-1318-2-ND] 1.0uF 6.3V 10% [Digikey: 490-1320-2-ND] 0603 - 0603 Surface Mount Capacitors 16 pF 50V 5% [Digikey: 445-5051-2-ND] 22 pF 50V [Digikey: PCC220ACVTR-ND] 33 pF 50V 5% [Digikey: 490-1415-1-ND] 56pF 50V 5% [Digikey: 490-1421-1-ND] 220pF 50V 5% [Digikey: 445-1285-1-ND] 680 pF 50V 2200 pF 50V 5% C0G [Digikey: 445-1297-1-ND] 5600 pF 100V 5% X7R [Digikey: 478-3711-1-ND] 0.1 µF 25V 10% [Digikey: PCC2277TR-ND] 0.22 µF 16V 10% X7R [Digikey: 445-1318-1-ND] 1.0 µF 25V 10% [Digikey: 445-5146-2-ND] 0603 - RF Specific 3pF 250V +/-0.1pF RF [Digikey: 712-1347-1-ND] 18 pF 250V 5% [Digikey: 478-3505-1-ND or 712-1322-1-ND] 56 pF 250V 5% C0G RF [Digikey: 490-4867-1-ND] 68 pF 250V RF [Digikey: 490-4868-1-ND] 0805 - 0805 Surface Mount Capacitors 220 pF 250V 2% RF Ceramic Capacitor [Digikey: 712-1398-1-ND] 1000 pF 50V 2% NP0 Ceramic Capacitor [Digikey: 478-3760-1-ND] 0.1 µF 25V 10% Ceramic Capacitor [Digikey: PCC1828TR-ND] 1.0 µF 16V 10% Ceramic Capacitor[Digikey: 490-1691-2-ND] 10.0 µF 10V 10% Ceramic Capacitor[Digikey: 709-1228-1-ND] 10.0 uF 16V 10% Ceramic Capacitor [Digikey: 478-5165-2-ND] 47 uF 6.3V 20% Ceramic Capacitor [Digikey: 587-1779-1-ND or 399-5506-1-ND] 1206 - 1206 Surface Mount Capacitors 47uF 10V 20% Ceramic Capacitor [Digikey: 490-5528-1-ND or 399-5508-1-ND or 445-6010-1-ND] 100uF 6.3V -20%, +80% Y5V Ceramic Capacitor (Digikey: 490-4512-1-ND, Mouser: 81-GRM31CF50J107ZE1L)
C15 C19 C28 = SparkFun-Capacitors:10UF: 10.0µF ceramic capacitors A capacitor is a passive two-terminal electrical component used to store electrical energy temporarily in an electric field.; PROD_ID: CAP-09824; VALUE: 10uF
C17 C25 C34 C49-C52 C65 C66 = SparkFun-Capacitors:1.0UF: 1µF ceramic capacitors A capacitor is a passive two-terminal electrical component used to store electrical energy temporarily in an electric field.; PROD_ID: CAP-00868
C42 C45 C47 C61-C64 = SparkFun-Capacitors:1.0UF: 1µF ceramic capacitors A capacitor is a passive two-terminal electrical component used to store electrical energy temporarily in an electric field.; PROD_ID: CAP-12417; VALUE: 1.0uF
D1-D4 = SparkFun-LED:LED: LED (Generic) Standard schematic elements and footprints for 5mm, 3mm, 1206, and 0603 sized LEDs. Generic LEDs with no color specified.
H1-H4 = holes:MOUNT-HOLE: MOUNTING HOLE with drill center marker
IC3 = MotorDriverCustomLibrary:STM32F071V8T6: STM32L1_Med_density_LQFP100 edit this description Auto generated by make-symbol-device-package-bsdl.ulp Rev. 44 Source: STM32L1_Med_density_LQFP100.bsd
J0 J1-J7 = con-lstb:MA03-1: PIN HEADER; OC_FARNELL: unknown; OC_NEWARK: unknown
J8 = con-lstb:MA03-2: PIN HEADER; OC_FARNELL: unknown; OC_NEWARK: unknown
J9-J16 = B4B-PH-K-S_LF__SN_:B4B-PH-K-S(LF)(SN): PH Series 4 Position 2 mm Pitch Through Hole Crimp Top Entry Shrouded Header; DESCRIPTION: Connector Header Through Hole 4 position 0.079 (2.00mm); DIGI-KEY_PART_NUMBER: 455-1706-ND; MF: JST Sales; MP: B4B-PH-K-S(LF)(SN); PACKAGE: None
J17 = con-lstb:MA20-2: PIN HEADER; OC_FARNELL: unknown; OC_NEWARK: unknown
J18-J25 = B2P-VH_LF__SN_:B2P-VH(LF)(SN): VH Series 3.96 mm Pitch, Compact, Lock Mechanism also Prevents Misinsertion; DESCRIPTION: Connector Header Through Hole 2 position 0.156 (3.96mm); DIGI-KEY_PART_NUMBER: 455-1639-ND; DIGIKEY-PURCHASE-URL: https://snapeda.com/shop?store=DigiKey&id=104373; MF: JST Sales; MP: B2P-VH(LF)(SN); PACKAGE: None
J26 = XT30PW:XT30PW
JTAG = SparkFun-Connectors:CORTEX_JTAG_DEBUG: Cortex Debug Connector - 10 pin Supports JTAG debug, Serial Wire debug, and Serial Wire Viewer. PTH and SMD connector options available. General Connector Information <http://infocenter.arm.com/help/topic/com.arm.doc.faqs/attached/13634/cortex_debug_connectors.pdf> Products: PTH Connector <http://www.digikey.com/product-detail/en/cnc-tech/3220-10-0100-00/1175-1627-ND/3883661> -via Digi-Key SparkFun PSoc <https://www.sparkfun.com/products/13229> SparkFun T <https://www.sparkfun.com/products/13810>
L1-L3 = FDSD0518-H-3R3M_P3:FDSD0518-H-3R3M=P3: Inductor, Shielded, 1.5uh, 6.2a, 20%; ARROW_ELECTRONICS-PURCHASE-URL: https://snapeda.com/shop?store=Arrow+Electronics&id=4548120; DESCRIPTION: Inductor with Inductance: 3.3uH Tol. +/-20%, Package: 2019 (5249); DIGI-KEY_PART_NUMBER: 490-10875-1-ND; DIGIKEY-PURCHASE-URL: https://snapeda.com/shop?store=DigiKey&id=4548120; MF: Murata; MOUSER-PURCHASE-URL: https://snapeda.com/shop?store=Mouser&id=4548120; MP: FDSD0518-H-3R3M=P3; PACKAGE: NONSTANDARD
M0 M1-M7 = VNH7100ASTR:VNH7100ASTR: None; ARROW_ELECTRONICS-PURCHASE-URL: https://snapeda.com/shop?store=Arrow+Electronics&id=1121640; DESCRIPTION: Motor Driver Power MOSFET PWM 16-SOIC; DIGI-KEY_PART_NUMBER: 497-17629-1-ND; MF: STMicroelectronics; MOUSER-PURCHASE-URL: https://snapeda.com/shop?store=Mouser&id=1121640; MP: VNH7100ASTR; PACKAGE: SOIC-16 STMicroelectronics
Q2 = SparkFun-DiscreteSemi:MOSFET_PCH: P-channel MOSFETs Voltage controlled devices that allow control of high current outputs. SparkFun Products: SparkFun ESP32 Thing <https://www.sparkfun.com/products/13907> SparkFun ESP8266 Thing <https://www.sparkfun.com/products/13231> SparkFun Pi Servo HAT V2 <https://www.sparkfun.com/products/15316> DMG2305UX-7 (20V/4.2A/SOT23-3); PROD_ID: TRAN-14388
R1-R3 R34 = SparkFun-Resistors:330OHM: 330Ω resistor A resistor is a passive two-terminal electrical component that implements electrical resistance as a circuit element. Resistors act to reduce current flow, and, at the same time, act to lower voltage levels within circuits. - Wikipedia; PROD_ID: RES-00818
R4 R35-R37 R41-R43 = SparkFun-Resistors:2.2KOHM: 2.2kΩ resistor A resistor is a passive two-terminal electrical component that implements electrical resistance as a circuit element. Resistors act to reduce current flow, and, at the same time, act to lower voltage levels within circuits. - Wikipedia; PROD_ID: RES-14341; VALUE: 2.2k
R5 R14 R19 = MCR01MZPJ000:MCR01MZPJ000: RC0402 0R I=2A 5% 0,063W; DESCRIPTION: 0 Ohms Jumper 0.063W, 1/16W Chip Resistor 0402 (1005 Metric) Automotive AEC-Q200 Thick Film; DIGI-KEY_PART_NUMBER: RHM0.0JCT-ND; MF: Rohm; MP: MCR01MZPJ000; PACKAGE: 1005 Rohm Semiconductor
R6 R9 R15 R18 R20 R23 R40 = MCR01MZPF1801:MCR01MZPF1801; DESCRIPTION: Res Thick Film 0402 1.8K Ohm 1% 0.063W(1/16W) ±100ppm/°C Pad SMD Automotive T/R; DIGI-KEY_PART_NUMBER: RHM1.80KLTR-ND; MF: Rohm; MP: MCR01MZPF1801; PACKAGE: 1005 Rohm Semiconductor
R7 R16 R21 = MCR01MZPF1203:MCR01MZPF1203; DESCRIPTION: RES SMD 120K OHM 1% 1/16W 0402; DIGI-KEY_PART_NUMBER: RHM120KLCT-ND; MF: Rohm; MP: MCR01MZPF1203; PACKAGE: 1005 Rohm Semiconductor
R8 R17 R22 = MCR01MZPF2202:MCR01MZPF2202; DESCRIPTION: Res Thick Film 0402 22K Ohm 1% 0.063W(1/16W) ±100ppm/°C Pad SMD Automotive T/R; DIGI-KEY_PART_NUMBER: RHM22.0KLTR-ND; MF: Rohm; MP: MCR01MZPF2202; PACKAGE: 1005 Rohm Semiconductor
R10 R11 R28-R31 R38 R39 = SparkFun-Resistors:10KOHM: 10kΩ resistor A resistor is a passive two-terminal electrical component that implements electrical resistance as a circuit element. Resistors act to reduce current flow, and, at the same time, act to lower voltage levels within circuits. - Wikipedia; PROD_ID: RES-00824
R12 R13 R32 R33 = SparkFun-Resistors:100OHM: 100Ω resistor A resistor is a passive two-terminal electrical component that implements electrical resistance as a circuit element. Resistors act to reduce current flow, and, at the same time, act to lower voltage levels within circuits. - Wikipedia; PROD_ID: RES-12438
R24-R27 = SparkFun-Resistors:124KOHM: 124kΩ resistor A resistor is a passive two-terminal electrical component that implements electrical resistance as a circuit element. Resistors act to reduce current flow, and, at the same time, act to lower voltage levels within circuits. - Wikipedia; PROD_ID: RES-14395; VALUE: 124k
SV1 = con-lstb:MA04-2: PIN HEADER; OC_FARNELL: unknown; OC_NEWARK: unknown
U1 = ICE5LP1K-SG48ITR:ICE5LP1K-SG48ITR: Ic Fpga 1100luts 1.2v 48qfn; DESCRIPTION: IC FPGA 39 I/O 48QFN; DIGI-KEY_PART_NUMBER: 220-2155-1-ND; MF: Lattice Semiconductor; MP: ICE5LP1K-SG48ITR; PACKAGE: QFN-48 Lattice Semiconductor
U2 = N25Q032A13ESC40FNew:N25Q032A13ESC40F; BUILT_BY: EMA_Jessica; COPYRIGHT: Copyright (C) 2016 Accelerated Designs. All rights reserved; MANUFACTURER_PART_NUMBER: N25Q032A13ESC40F; SOURCELIBRARY: Micron_2018-04-06; VENDOR: Micron
U3 U4 U6 = BD9D323QWZ:BD9D323QWZ-E2; BUILT_BY: EMA_Molly; COPYRIGHT: Copyright (C) 2018 Accelerated Designs. All rights reserved; MANUFACTURER_PART_NUMBER: BD9D323QWZ-E2; SOURCELIBRARY: ROHM_2019-10-21; VENDOR: ROHM Semiconductor
U5 = MMDT5401:MMDT5401-7-F; BUILT_BY: EMA_UL_Team; MANUFACTURER_PART_NUMBER: MMDT5401-7-F; SOURCELIBRARY: DIODESINC_2_2015-08-18; VENDOR: Diodes Inc
U7 = MIC5504-3.3YM5-TR:MIC5504-3.3YM5-TR; BUILT_BY: EMA_Jessica; COPYRIGHT: Copyright (C) 2018 Accelerated Designs. All rights reserved; MANUFACTURER_PART_NUMBER: MIC5504-3.3YM5-TR; SOURCELIBRARY: Microchip_2019-08-23_21; VENDOR: Microchip
U8 = MIC5365-1.2YC5:MIC5365-1.2YC5-TR; BUILT_BY: EMA_Jessica; COPYRIGHT: Copyright (C) 2018 Accelerated Designs. All rights reserved; MANUFACTURER_PART_NUMBER: MIC5365-1.2YC5-TR; SOURCELIBRARY: Microchip_2019-08-23_3; VENDOR: Microchip
U9-U11 = LD1085D2T33:LD1085D2T33R; BUILT_BY: EMA_UL_Team; MANUFACTURER_PART_NUMBER: LD1085D2T33R; SOURCELIBRARY: StMicro_2011-06-07; VENDOR: STMicroelectronics
U12 = BNO055:BNO055: BNO055 9-axis Absolute Orientation Sensor ( SiP ) w/Sensors and Sensor Fusion; DESCRIPTION: Accelerometer, Gyroscope, Magnetometer, 9 Axis Sensor I²C, UART Output; DIGI-KEY_PART_NUMBER: 828-1058-1-ND; DIGIKEY-PURCHASE-URL: https://snapeda.com/shop?store=DigiKey&id=51961; MF: Bosch; MOUSER-PURCHASE-URL: https://snapeda.com/shop?store=Mouser&id=51961; MP: BNO055; PACKAGE: LGA-28 Bosch
Y1 = ECS-TXO-2520-33-160-AN-TR:ECS-TXO-2520-33-160-AN-TR: miniatue SMD HCMOS TCXO Oscillator.; DESCRIPTION: 16MHz TCXO HCMOS Oscillator 3.3V Enable/Disable 4-SMD, No Lead; DIGI-KEY_PART_NUMBER: XC2255CT-ND; MF: ECS Inc.; MP: ECS-TXO-2520-33-160-AN-TR; PACKAGE: SMD-4 ECS International
Y2 = SparkFun-Clocks:CRYSTAL-32.768KHZ: 32.768kHz Crystal Frequency: 32.768kHz Frequency Stability: ±20ppm Load Capacitance: 12.5pF (PTH-2X6 & SMD-3.2X1.5), 6pF (SMD-2X6) SparkFun Products: SparkFun BigTime Watch Kit <https://www.sparkfun.com/products/11734> SparkFun nRF52832 Breakout <https://www.sparkfun.com/products/13990> SparkFun Real Time Clock Module <https://www.sparkfun.com/products/12708>; PROD_ID: XTAL-13062
Y4 = SparkFun-Clocks:CRYSTAL-GROUNDED: Crystals w/ Ground Pin (Generic) These are passive quartz crystals, which can be used as a clock source for a microcontroller. Crystal's are usually two-terminal devices. A third terminal may be optionally connected to ground, as recommended by the manufaturer.